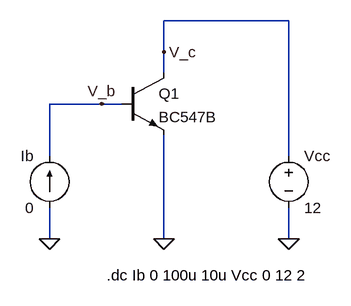
[diagram p0: schematic Q31.asc]
Q31.asc, the LTspice schematic file:
Version 4.1
SHEET 1 880 680
WIRE 416 48 224 48
WIRE 224 96 224 48
WIRE 224 128 224 96
WIRE 128 176 48 176
WIRE 160 176 128 176
WIRE 48 256 48 176
WIRE 416 256 416 48
WIRE 48 384 48 336
WIRE 224 384 224 224
WIRE 416 384 416 336
FLAG 48 384 0
FLAG 224 384 0
FLAG 416 384 0
FLAG 128 176 V_b
FLAG 224 96 V_c
SYMBOL npn 160 128 R0
SYMATTR InstName Q1
SYMATTR Value BC547B
SYMBOL current 48 336 R180
WINDOW 0 24 80 Left 2
WINDOW 3 24 0 Left 2
WINDOW 123 0 0 Left 0
WINDOW 39 0 0 Left 0
SYMATTR InstName Ib
SYMATTR Value 0
SYMBOL voltage 416 240 R0
WINDOW 123 0 0 Left 0
WINDOW 39 0 0 Left 0
SYMATTR InstName Vcc
SYMATTR Value 12
TEXT 136 440 Left 2 !.dc Ib 0 100u 10u Vcc 0 12 2

The netlist it stands for:
* Q31.asc
Q1 V_c V_b 0 0 BC547B
Ib 0 V_b 0
Vcc V_c 0 12
.model NPN NPN
.model PNP PNP
.lib standard.bjt
.dc Ib 0 100u 10u Vcc 0 12 2
.backanno
.end